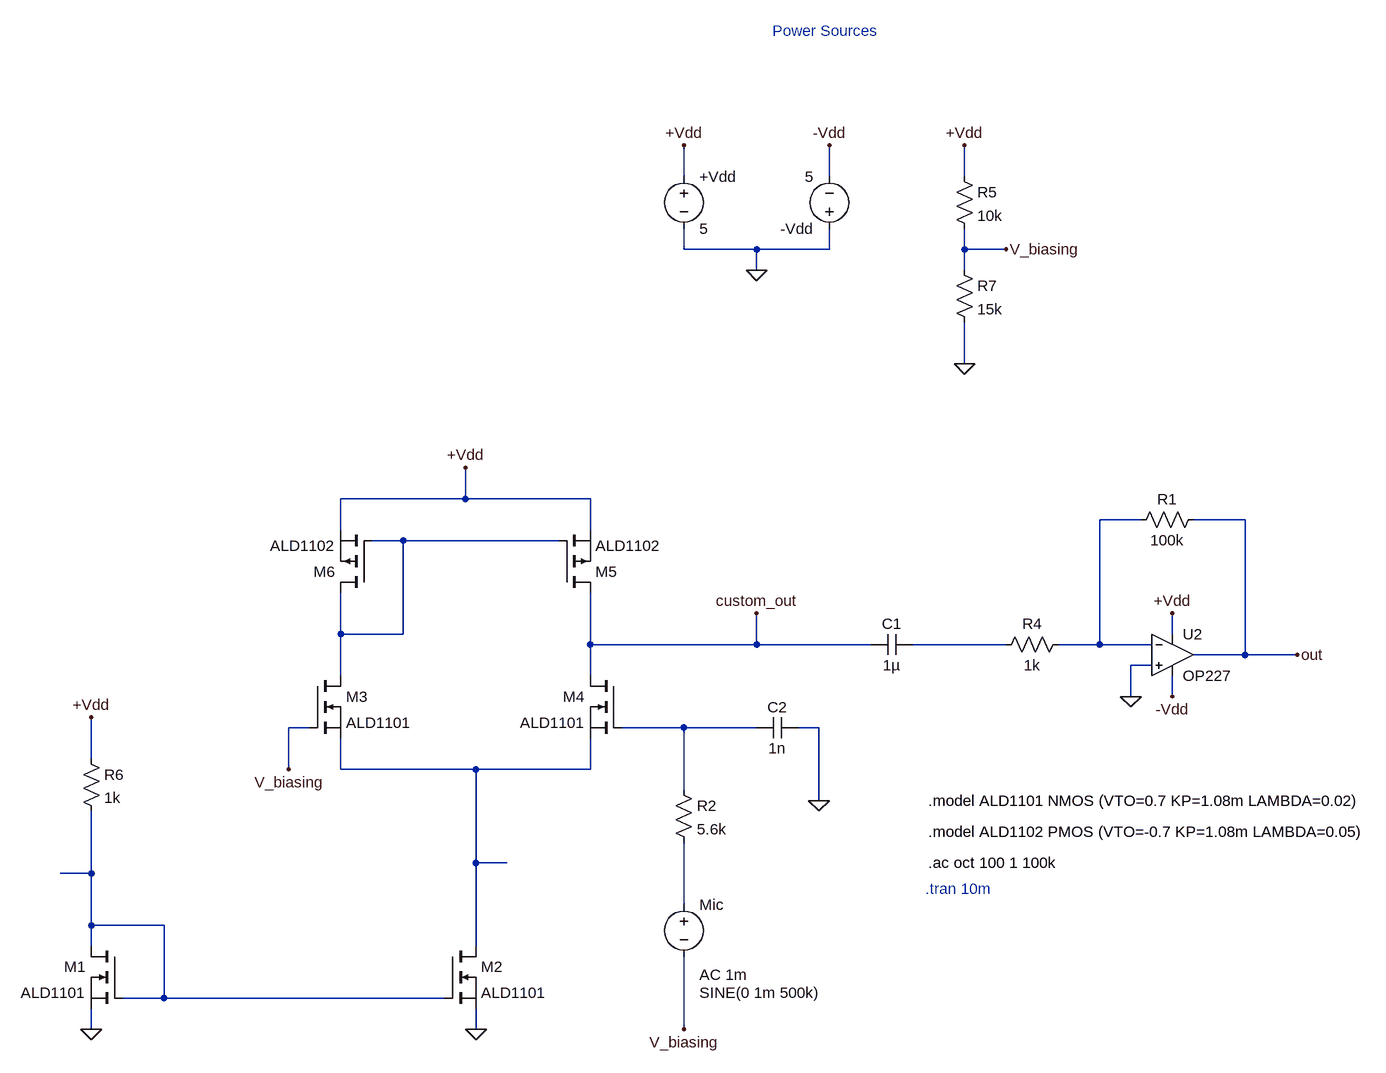
[diagram p0: schematic FinalProject_v4.asc]
FinalProject_v4.asc, the LTspice schematic file:
Version 4
SHEET 1 3940 1304
WIRE 2512 -880 2512 -928
WIRE 2736 -880 2736 -928
WIRE 2944 -880 2944 -928
WIRE 2512 -768 2512 -800
WIRE 2624 -768 2512 -768
WIRE 2736 -768 2736 -800
WIRE 2736 -768 2624 -768
WIRE 2944 -768 2944 -800
WIRE 3008 -768 2944 -768
WIRE 2624 -736 2624 -768
WIRE 2944 -736 2944 -768
WIRE 2944 -592 2944 -656
WIRE 2176 -384 2176 -432
WIRE 2176 -384 1984 -384
WIRE 2368 -384 2176 -384
WIRE 3216 -352 3152 -352
WIRE 3376 -352 3296 -352
WIRE 1984 -336 1984 -384
WIRE 2368 -336 2368 -384
WIRE 2080 -320 2032 -320
WIRE 2320 -320 2080 -320
WIRE 1984 -176 1984 -240
WIRE 2080 -176 2080 -320
WIRE 2080 -176 1984 -176
WIRE 3264 -176 3264 -208
WIRE 2368 -160 2368 -240
WIRE 2624 -160 2624 -208
WIRE 2624 -160 2368 -160
WIRE 2800 -160 2624 -160
WIRE 3008 -160 2864 -160
WIRE 3152 -160 3152 -352
WIRE 3152 -160 3088 -160
WIRE 3232 -160 3152 -160
WIRE 3376 -144 3376 -352
WIRE 3376 -144 3296 -144
WIRE 3456 -144 3376 -144
WIRE 3232 -128 3200 -128
WIRE 1984 -112 1984 -176
WIRE 2368 -112 2368 -160
WIRE 3200 -80 3200 -128
WIRE 3264 -80 3264 -112
WIRE 1936 -32 1904 -32
WIRE 2512 -32 2416 -32
WIRE 2624 -32 2512 -32
WIRE 2720 -32 2688 -32
WIRE 1600 16 1600 -48
WIRE 1904 32 1904 -32
WIRE 1984 32 1984 -16
WIRE 2192 32 1984 32
WIRE 2368 32 2368 -16
WIRE 2368 32 2192 32
WIRE 2512 64 2512 -32
WIRE 2720 80 2720 -32
WIRE 2192 176 2192 32
WIRE 2240 176 2192 176
WIRE 1600 192 1600 96
WIRE 1600 192 1552 192
WIRE 2512 240 2512 144
WIRE 1600 272 1600 192
WIRE 1712 272 1600 272
WIRE 1600 304 1600 272
WIRE 2192 304 2192 176
WIRE 1712 384 1712 272
WIRE 1712 384 1648 384
WIRE 2144 384 1712 384
WIRE 1600 432 1600 400
WIRE 2192 432 2192 400
WIRE 2512 432 2512 320
FLAG 2624 -736 0
FLAG 2512 -928 +Vdd
FLAG 2736 -928 -Vdd
FLAG 3200 -80 0
FLAG 3264 -208 +Vdd
FLAG 3264 -80 -Vdd
FLAG 2624 -208 custom_out
FLAG 2176 -432 +Vdd
FLAG 1600 -48 +Vdd
FLAG 1600 432 0
FLAG 2192 432 0
FLAG 3008 -768 V_biasing
FLAG 1904 32 V_biasing
FLAG 2944 -592 0
FLAG 2944 -928 +Vdd
FLAG 2512 432 V_biasing
FLAG 3456 -144 out
FLAG 2720 80 0
DATAFLAG 2240 176 "Id(M2)"
DATAFLAG 1552 192 "Id(M1)"
SYMBOL voltage 2512 -896 R0
WINDOW 123 0 0 Left 0
WINDOW 39 0 0 Left 0
SYMATTR InstName +Vdd
SYMATTR Value 5
SYMBOL voltage 2736 -784 R180
WINDOW 123 0 0 Left 0
WINDOW 39 0 0 Left 0
SYMATTR InstName -Vdd
SYMATTR Value 5
SYMBOL OpAmps\\OP227 3264 -208 R0
SYMATTR InstName U2
SYMBOL res 3312 -368 R90
WINDOW 0 0 56 VBottom 2
WINDOW 3 32 56 VTop 2
SYMATTR InstName R1
SYMATTR Value 100k
SYMBOL res 3104 -176 R90
WINDOW 0 0 56 VBottom 2
WINDOW 3 32 56 VTop 2
SYMATTR InstName R4
SYMATTR Value 1k
SYMBOL voltage 2512 224 R0
WINDOW 123 24 124 Left 2
WINDOW 39 0 0 Left 0
WINDOW 3 24 152 Left 2
SYMATTR Value2 AC 1m
SYMATTR InstName Mic
SYMATTR Value SINE(0 1m 500k)
SYMBOL pmos 2320 -240 M180
SYMATTR InstName M5
SYMATTR Value ALD1102
SYMBOL pmos 2032 -240 R180
SYMATTR InstName M6
SYMATTR Value ALD1102
SYMBOL res 1584 0 R0
SYMATTR InstName R6
SYMATTR Value 1k
SYMBOL nmos 1648 304 M0
SYMATTR InstName M1
SYMATTR Value ALD1101
SYMBOL nmos 2144 304 R0
SYMATTR InstName M2
SYMATTR Value ALD1101
SYMBOL nmos 1936 -112 R0
SYMATTR InstName M3
SYMATTR Value ALD1101
SYMBOL nmos 2416 -112 M0
SYMATTR InstName M4
SYMATTR Value ALD1101
SYMBOL res 2928 -896 R0
SYMATTR InstName R5
SYMATTR Value 10k
SYMBOL res 2928 -752 R0
SYMATTR InstName R7
SYMATTR Value 15k
SYMBOL res 2496 48 R0
SYMATTR InstName R2
SYMATTR Value 5.6k
SYMBOL cap 2688 -48 R90
WINDOW 0 0 32 VBottom 2
WINDOW 3 32 32 VTop 2
SYMATTR InstName C2
SYMATTR Value 1n
SYMBOL cap 2864 -176 R90
WINDOW 0 0 32 VBottom 2
WINDOW 3 32 32 VTop 2
SYMATTR InstName C1
SYMATTR Value 1µ
TEXT 2888 176 Left 2 !.ac oct 100 1 100k
TEXT 2648 -1104 Left 2 ;Power Sources
TEXT 2888 128 Left 2 !.model ALD1102 PMOS (VTO=-0.7 KP=1.08m LAMBDA=0.05)
TEXT 2888 80 Left 2 !.model ALD1101 NMOS (VTO=0.7 KP=1.08m LAMBDA=0.02)
TEXT 2884 216 Left 2 ;.tran 10m

The netlist it stands for:
* FinalProject_v4.asc
V§+Vdd +Vdd 0 5
V§-Vdd 0 -Vdd 5
XU2 0 N001 +Vdd -Vdd out OP227  ; pins In+ In- V+ V- OUT
R1 out N001 100k
R4 N001 N003 1k
V§Mic N007 V_biasing SINE(0 1m 500k) AC 1m
M5 custom_out N002 +Vdd +Vdd ALD1102
M6 N002 N002 +Vdd +Vdd ALD1102
R6 +Vdd N006 1k
M1 N006 N006 0 0 ALD1101
M2 N005 N006 0 0 ALD1101
M3 N002 V_biasing N005 N005 ALD1101
M4 custom_out N004 N005 N005 ALD1101
R5 +Vdd V_biasing 10k
R7 V_biasing 0 15k
R2 N004 N007 5.6k
C2 0 N004 1n
C1 N003 custom_out 1µ
.model NMOS NMOS
.model PMOS PMOS
.lib standard.mos
.ac oct 100 1 100k
* Power Sources
.model ALD1102 PMOS (VTO=-0.7 KP=1.08m LAMBDA=0.05)
.model ALD1101 NMOS (VTO=0.7 KP=1.08m LAMBDA=0.02)
* .tran 10m
.backanno
.end